# EAGLE design 4-saw-oscillators_rev_1.1 (EAGLE 6.4)
Parts Silver mica 220pF: CD15FD221JO3F, mouser @Kr 4,64 pr stk SSM2212: SSM2212RZ, digi-key @$6.055 pr stk for 10 Tempco: LT300014T261K0J, mouser, @Kr 2.72 pr stk 220k pot: 858-67WR250KLF (250k), mouser @Kr. 5,16 pr. stk 25k pot: 67WR25KLF, mouser @Kr. 6,13 pr. stk 10k pot: 67WR10KLF, mouser @Kr. 6,13 pr. stk
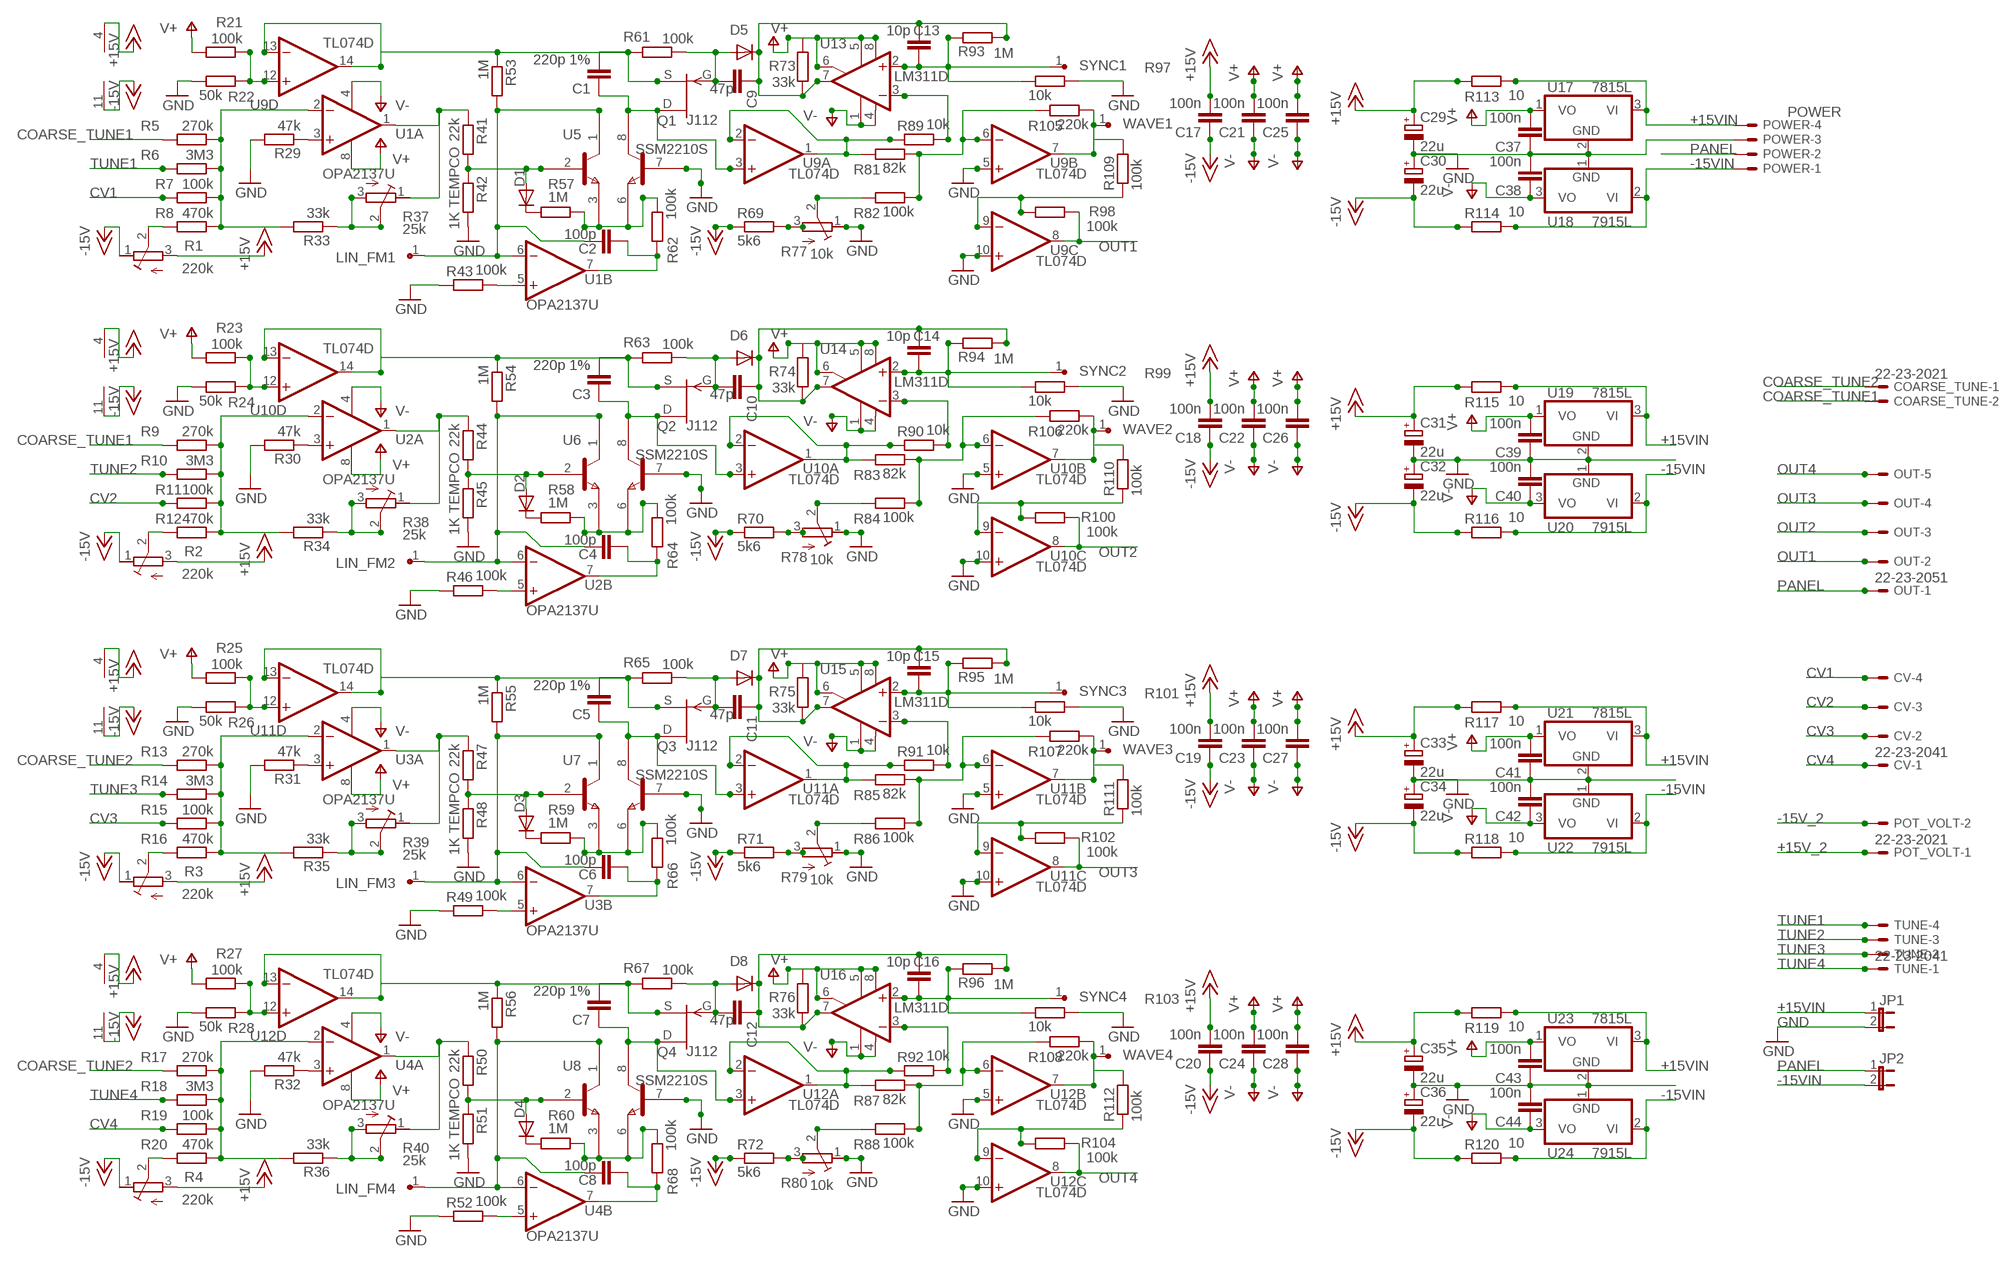
[diagram p0: schematic, sheet 1]

## Parts
C1  220p 1%  C-EU059-025X117  [C059-025X117]
C2  100p  C-EU025-025X050  [C025-025X050]
C3  220p 1%  C-EU059-025X117  [C059-025X117]
C4  100p  C-EU025-025X050  [C025-025X050]
C5  220p 1%  C-EU059-025X117  [C059-025X117]
C6  100p  C-EU025-025X050  [C025-025X050]
C7  220p 1%  C-EU059-025X117  [C059-025X117]
C8  100p  C-EU025-025X050  [C025-025X050]
C9  47p  C-EU025-025X050  [C025-025X050]
C10  47p  C-EU025-025X050  [C025-025X050]
C11  47p  C-EU025-025X050  [C025-025X050]
C12  47p  C-EU025-025X050  [C025-025X050]
C13  10p  C-EU050-025X075  [C050-025X075]
C14  10p  C-EU050-025X075  [C050-025X075]
C15  10p  C-EU050-025X075  [C050-025X075]
C16  10p  C-EU050-025X075  [C050-025X075]
C17  100n  C-EU025-024X044  [C025-024X044]
C18  100n  C-EU025-024X044  [C025-024X044]
C19  100n  C-EU025-024X044  [C025-024X044]
C20  100n  C-EU025-024X044  [C025-024X044]
C21  100n  C-EU025-024X044  [C025-024X044]
C22  100n  C-EU025-024X044  [C025-024X044]
C23  100n  C-EU025-024X044  [C025-024X044]
C24  100n  C-EU025-024X044  [C025-024X044]
C25  100n  C-EU025-024X044  [C025-024X044]
C26  100n  C-EU025-024X044  [C025-024X044]
C27  100n  C-EU025-024X044  [C025-024X044]
C28  100n  C-EU025-024X044  [C025-024X044]
C29  22u  CPOL-EUE2-5  [E2-5]
C30  22u  CPOL-EUE2-5  [E2-5]
C31  22u  CPOL-EUE2-5  [E2-5]
C32  22u  CPOL-EUE2-5  [E2-5]
C33  22u  CPOL-EUE2-5  [E2-5]
C34  22u  CPOL-EUE2-5  [E2-5]
C35  22u  CPOL-EUE2-5  [E2-5]
C36  22u  CPOL-EUE2-5  [E2-5]
C37  100n  C-EU025-024X044  [C025-024X044]
C38  100n  C-EU025-024X044  [C025-024X044]
C39  100n  C-EU025-024X044  [C025-024X044]
C40  100n  C-EU025-024X044  [C025-024X044]
C41  100n  C-EU025-024X044  [C025-024X044]
C42  100n  C-EU025-024X044  [C025-024X044]
C43  100n  C-EU025-024X044  [C025-024X044]
C44  100n  C-EU025-024X044  [C025-024X044]
COARSE_TUNE  22-23-2021  [22-23-2021]
CV  22-23-2041  [22-23-2041]
D1  1N4148  DIODE-D-5  [D-5]
D2  1N4148  DIODE-D-5  [D-5]
D3  1N4148  DIODE-D-5  [D-5]
D4  1N4148  DIODE-D-5  [D-5]
D5  1N4148  DIODE-D-5  [D-5]
D6  1N4148  DIODE-D-5  [D-5]
D7  1N4148  DIODE-D-5  [D-5]
D8  1N4148  DIODE-D-5  [D-5]
JP1  JP1E  [JP1]
JP2  JP1E  [JP1]
LIN_FM1  SINGLE_PAD  [SINGLE_PAD]
LIN_FM2  SINGLE_PAD  [SINGLE_PAD]
LIN_FM3  SINGLE_PAD  [SINGLE_PAD]
LIN_FM4  SINGLE_PAD  [SINGLE_PAD]
OUT  22-23-2051  [22-23-2051]
POT_VOLT  22-23-2021  [22-23-2021]
POWER  POWER  KK-156-4  [KK-156-4]
Q1  J112  [TO92]
Q2  J112  [TO92]
Q3  J112  [TO92]
Q4  J112  [TO92]
R1  220k  R-TRIMMT93YA  [RTRIMT93YA]
R2  220k  R-TRIMMT93YA  [RTRIMT93YA]
R3  220k  R-TRIMMT93YA  [RTRIMT93YA]
R4  220k  R-TRIMMT93YA  [RTRIMT93YA]
R5  270k  R-EU_0204/5  [0204/5]
R6  3M3  R-EU_0204/5  [0204/5]
R7  100k  R-EU_0204/5  [0204/5]
R8  470k  R-EU_0204/5  [0204/5]
R9  270k  R-EU_0204/5  [0204/5]
R10  3M3  R-EU_0204/5  [0204/5]
R11  100k  R-EU_0204/5  [0204/5]
R12  470k  R-EU_0204/5  [0204/5]
R13  270k  R-EU_0204/5  [0204/5]
R14  3M3  R-EU_0204/5  [0204/5]
R15  100k  R-EU_0204/5  [0204/5]
R16  470k  R-EU_0204/5  [0204/5]
R17  270k  R-EU_0204/5  [0204/5]
R18  3M3  R-EU_0204/5  [0204/5]
R19  100k  R-EU_0204/5  [0204/5]
R20  470k  R-EU_0204/5  [0204/5]
R21  100k  R-EU_0204/5  [0204/5]
R22  50k  R-EU_0204/5  [0204/5]
R23  100k  R-EU_0204/5  [0204/5]
R24  50k  R-EU_0204/5  [0204/5]
R25  100k  R-EU_0204/5  [0204/5]
R26  50k  R-EU_0204/5  [0204/5]
R27  100k  R-EU_0204/5  [0204/5]
R28  50k  R-EU_0204/5  [0204/5]
R29  47k  R-EU_0204/5  [0204/5]
R30  47k  R-EU_0204/5  [0204/5]
R31  47k  R-EU_0204/5  [0204/5]
R32  47k  R-EU_0204/5  [0204/5]
R33  33k  R-EU_0204/5  [0204/5]
R34  33k  R-EU_0204/5  [0204/5]
R35  33k  R-EU_0204/5  [0204/5]
R36  33k  R-EU_0204/5  [0204/5]
R37  25k  R-TRIMMT93YA  [RTRIMT93YA]
R38  25k  R-TRIMMT93YA  [RTRIMT93YA]
R39  25k  R-TRIMMT93YA  [RTRIMT93YA]
R40  25k  R-TRIMMT93YA  [RTRIMT93YA]
R41  22k  R-EU_0204/5  [0204/5]
R42  1K TEMPCO  R-EU_0204/7  [0204/7]
R43  100k  R-EU_0204/5  [0204/5]
R44  22k  R-EU_0204/5  [0204/5]
R45  1K TEMPCO  R-EU_0204/7  [0204/7]
R46  100k  R-EU_0204/5  [0204/5]
R47  22k  R-EU_0204/5  [0204/5]
R48  1K TEMPCO  R-EU_0204/7  [0204/7]
R49  100k  R-EU_0204/5  [0204/5]
R50  22k  R-EU_0204/5  [0204/5]
R51  1K TEMPCO  R-EU_0204/7  [0204/7]
R52  100k  R-EU_0204/5  [0204/5]
R53  1M  R-EU_0204/5  [0204/5]
R54  1M  R-EU_0204/5  [0204/5]
R55  1M  R-EU_0204/5  [0204/5]
R56  1M  R-EU_0204/5  [0204/5]
R57  1M  R-EU_0204/5  [0204/5]
R58  1M  R-EU_0204/5  [0204/5]
R59  1M  R-EU_0204/5  [0204/5]
R60  1M  R-EU_0204/5  [0204/5]
R61  100k  R-EU_0204/5  [0204/5]
R62  100k  R-EU_0204/5  [0204/5]
R63  100k  R-EU_0204/5  [0204/5]
R64  100k  R-EU_0204/5  [0204/5]
R65  100k  R-EU_0204/5  [0204/5]
R66  100k  R-EU_0204/5  [0204/5]
R67  100k  R-EU_0204/5  [0204/5]
R68  100k  R-EU_0204/5  [0204/5]
R69  5k6  R-EU_0204/5  [0204/5]
R70  5k6  R-EU_0204/5  [0204/5]
R71  5k6  R-EU_0204/5  [0204/5]
R72  5k6  R-EU_0204/5  [0204/5]
R73  33k  R-EU_0204/5  [0204/5]
R74  33k  R-EU_0204/5  [0204/5]
R75  33k  R-EU_0204/5  [0204/5]
R76  33k  R-EU_0204/5  [0204/5]
R77  10k  R-TRIMMT93YA  [RTRIMT93YA]
R78  10k  R-TRIMMT93YA  [RTRIMT93YA]
R79  10k  R-TRIMMT93YA  [RTRIMT93YA]
R80  10k  R-TRIMMT93YA  [RTRIMT93YA]
R81  82k  R-EU_0204/5  [0204/5]
R82  100k  R-EU_0204/5  [0204/5]
R83  82k  R-EU_0204/5  [0204/5]
R84  100k  R-EU_0204/5  [0204/5]
R85  82k  R-EU_0204/5  [0204/5]
R86  100k  R-EU_0204/5  [0204/5]
R87  82k  R-EU_0204/5  [0204/5]
R88  100k  R-EU_0204/5  [0204/5]
R89  10k  R-EU_0204/5  [0204/5]
R90  10k  R-EU_0204/5  [0204/5]
R91  10k  R-EU_0204/5  [0204/5]
R92  10k  R-EU_0204/5  [0204/5]
R93  1M  R-EU_0204/5  [0204/5]
R94  1M  R-EU_0204/5  [0204/5]
R95  1M  R-EU_0204/5  [0204/5]
R96  1M  R-EU_0204/5  [0204/5]
R97  10k  R-EU_0204/5  [0204/5]
R98  100k  R-EU_0204/5  [0204/5]
R99  10k  R-EU_0204/5  [0204/5]
R100  100k  R-EU_0204/5  [0204/5]
R101  10k  R-EU_0204/5  [0204/5]
R102  100k  R-EU_0204/5  [0204/5]
R103  10k  R-EU_0204/5  [0204/5]
R104  100k  R-EU_0204/5  [0204/5]
R105  220k  R-EU_0204/5  [0204/5]
R106  220k  R-EU_0204/5  [0204/5]
R107  220k  R-EU_0204/5  [0204/5]
R108  220k  R-EU_0204/5  [0204/5]
R109  100k  R-EU_0204/5  [0204/5]
R110  100k  R-EU_0204/5  [0204/5]
R111  100k  R-EU_0204/5  [0204/5]
R112  100k  R-EU_0204/5  [0204/5]
R113  10  R-EU_0204/2V  [0204V]
R114  10  R-EU_0204/2V  [0204V]
R115  10  R-EU_0204/2V  [0204V]
R116  10  R-EU_0204/2V  [0204V]
R117  10  R-EU_0204/2V  [0204V]
R118  10  R-EU_0204/2V  [0204V]
R119  10  R-EU_0204/2V  [0204V]
R120  10  R-EU_0204/2V  [0204V]
SYNC1  SINGLE_PAD  [SINGLE_PAD]
SYNC2  SINGLE_PAD  [SINGLE_PAD]
SYNC3  SINGLE_PAD  [SINGLE_PAD]
SYNC4  SINGLE_PAD  [SINGLE_PAD]
TUNE  22-23-2041  [22-23-2041]
U1  OPA2137U  [SO08]
U2  OPA2137U  [SO08]
U3  OPA2137U  [SO08]
U4  OPA2137U  [SO08]
U5  SSM2210S  [SO08@1]
U6  SSM2210S  [SO08@1]
U7  SSM2210S  [SO08@1]
U8  SSM2210S  [SO08@1]
U9  TL074D  [SO14]
U10  TL074D  [SO14]
U11  TL074D  [SO14]
U12  TL074D  [SO14]
U13  LM311D  [SO08]
U14  LM311D  [SO08]
U15  LM311D  [SO08]
U16  LM311D  [SO08]
U17  7815L  [TO92]
U18  7915L  [TO92]
U19  7815L  [TO92]
U20  7915L  [TO92]
U21  7815L  [TO92]
U22  7915L  [TO92]
U23  7815L  [TO92]
U24  7915L  [TO92]
WAVE1  SINGLE_PAD  [SINGLE_PAD]
WAVE2  SINGLE_PAD  [SINGLE_PAD]
WAVE3  SINGLE_PAD  [SINGLE_PAD]
WAVE4  SINGLE_PAD  [SINGLE_PAD]

## Nets
+15V_1: C17.2 C29.+ R113.1 U9.4(P:V+) ; supply symbol labelled +15V
+15V_2: C18.2 C31.+ POT_VOLT.1 R1.3(E) R2.3(E) R115.1 U10.4(P:V+) ; supply symbol labelled +15V
+15V_3: C19.2 C33.+ R117.1 U11.4(P:V+) ; supply symbol labelled +15V
+15V_4: C20.2 C35.+ R3.3(E) R4.3(E) R119.1 U12.4(P:V+) ; supply symbol labelled +15V
+15VIN: JP1.1 POWER.4 R113.2 R115.2 R117.2 R119.2 U17.3(VI) U19.3(VI) U21.3(VI) U23.3(VI)
-15V_1: C17.1 C30.- R69.1 R114.1 U9.11(P:V-) ; supply symbol labelled -15V
-15V_2: C18.1 C32.- POT_VOLT.2 R1.1(A) R2.1(A) R70.1 R116.1 U10.11(P:V-) ; supply symbol labelled -15V
-15V_3: C19.1 C34.- R71.1 R118.1 U11.11(P:V-) ; supply symbol labelled -15V
-15V_4: C20.1 C36.- R3.1(A) R4.1(A) R72.1 R120.1 U12.11(P:V-) ; supply symbol labelled -15V
-15VIN: JP2.2 POWER.1 R114.2 R116.2 R118.2 R120.2 U18.2(VI) U20.2(VI) U22.2(VI) U24.2(VI)
COARSE_TUNE1: COARSE_TUNE.2 R5.2 R9.2
COARSE_TUNE2: COARSE_TUNE.1 R13.2 R17.2
CV1: CV.4 R7.2
CV2: CV.3 R11.2
CV3: CV.2 R15.2
CV4: CV.1 R19.2
GND: C29.- C30.+ C31.- C32.+ C33.- C34.+ C35.- C36.+ C37.1 C38.2 C39.1 C40.2 C41.1 C42.2 C43.1 C44.2 JP1.2 POWER.3 R22.1 R24.1 R26.1 R28.1 R29.2 R30.2 R31.2 R32.2 R42.2 R43.1 R45.2 R46.1 R48.2 R49.1 R51.2 R52.1 R77.1(A) R78.1(A) R79.1(A) R80.1(A) R97.2 R99.2 R101.2 R103.2 U5.7(B2) U6.7(B2) U7.7(B2) U8.7(B2) U9.5(B:+IN) U9.10(C:+IN) U10.5(B:+IN) U10.10(C:+IN) U11.5(B:+IN) U11.10(C:+IN) U12.5(B:+IN) U12.10(C:+IN) U17.2(GND) U18.1(GND) U19.2(GND) U20.1(GND) U21.2(GND) U22.1(GND) U23.2(GND) U24.1(GND)
N$1: D1.A R41.2 R42.1 U5.2(B1)
N$2: R21.1 R22.2 U9.12(D:+IN)
N$3: C1.2 Q1.2(S) R53.1 R61.2 U9.13(D:-IN) U9.14(D:OUT)
N$4: R23.1 R24.2 U10.12(D:+IN)
N$5: R57.2 R62.2 U5.3(E1) U5.6(E2)
N$6: R29.1 U1.3(A:+IN)
N$7: C2.2 R62.1 U1.7(B:OUT)
N$8: R37.1(A) R41.1 U1.1(A:OUT)
N$9: R43.2 U1.5(B:+IN)
N$10: C2.1 LIN_FM1.1 R53.2 U1.6(B:-IN) U5.1(C1)
N$11: C1.1 Q1.1(D) U5.8(C2) U9.3(A:+IN)
N$12: R81.1 R89.1 U9.1(A:OUT) U9.2(A:-IN)
N$13: D1.C R57.1
N$14: C9.2 D5.A Q1.3(G) R61.1
N$15: C9.1 C13.2 D5.C R73.1 R93.1 U13.7(OUT)
N$16: R69.2 R77.3(E)
N$17: R89.2 U13.3(-IN)
N$18: C13.1 R93.2 R97.1 SYNC1.1 U13.2(+IN)
N$19: R81.2 R82.1 R105.1 U9.6(B:-IN)
N$20: R33.1 R37.2(S) R37.3(E)
N$21: C3.2 Q2.2(S) R54.1 R63.2 U10.13(D:-IN) U10.14(D:OUT)
N$22: R1.2(S) R8.2
N$23: R77.2(S) R82.2
N$24: R98.1 R109.1 U9.9(C:-IN)
N$25: R38.1(A) R44.1 U2.1(A:OUT)
N$26: D2.A R44.2 R45.1 U6.2(B1)
N$27: R58.2 R64.2 U6.3(E1) U6.6(E2)
N$28: C4.2 R64.1 U2.7(B:OUT)
N$29: C4.1 LIN_FM2.1 R54.2 U2.6(B:-IN) U6.1(C1)
N$30: C3.1 Q2.1(D) U6.8(C2) U10.3(A:+IN)
N$31: R83.1 R90.1 U10.1(A:OUT) U10.2(A:-IN)
N$32: D2.C R58.1
N$33: C10.2 D6.A Q2.3(G) R63.1
N$34: C10.1 C14.2 D6.C R74.1 R94.1 U14.7(OUT)
N$35: R90.2 U14.3(-IN)
N$36: C14.1 R94.2 R99.1 SYNC2.1 U14.2(+IN)
N$37: R83.2 R84.1 R106.1 U10.6(B:-IN)
N$38: R2.2(S) R12.2
N$39: R78.2(S) R84.2
N$40: R70.2 R78.3(E)
N$41: R34.1 R38.2(S) R38.3(E)
N$42: R100.1 R110.1 U10.9(C:-IN)
N$43: R46.2 U2.5(B:+IN)
N$44: R30.1 U2.3(A:+IN)
N$45: R9.1 R10.1 R11.1 R12.1 R34.2 U2.2(A:-IN)
N$46: R25.1 R26.2 U11.12(D:+IN)
N$47: C5.2 Q3.2(S) R55.1 R65.2 U11.13(D:-IN) U11.14(D:OUT)
N$48: R39.1(A) R47.1 U3.1(A:OUT)
N$49: D3.A R47.2 R48.1 U7.2(B1)
N$50: R59.2 R66.2 U7.3(E1) U7.6(E2)
N$51: C6.2 R66.1 U3.7(B:OUT)
N$52: C6.1 LIN_FM3.1 R55.2 U3.6(B:-IN) U7.1(C1)
N$53: C5.1 Q3.1(D) U7.8(C2) U11.3(A:+IN)
N$54: R85.1 R91.1 U11.1(A:OUT) U11.2(A:-IN)
N$55: D3.C R59.1
N$56: C11.2 D7.A Q3.3(G) R65.1
N$57: C11.1 C15.2 D7.C R75.1 R95.1 U15.7(OUT)
N$58: R91.2 U15.3(-IN)
N$59: C15.1 R95.2 R101.1 SYNC3.1 U15.2(+IN)
N$60: R85.2 R86.1 R107.1 U11.6(B:-IN)
N$61: R3.2(S) R16.2
N$62: R79.2(S) R86.2
N$63: R71.2 R79.3(E)
N$64: R35.1 R39.2(S) R39.3(E)
N$65: R102.1 R111.1 U11.9(C:-IN)
N$66: R49.2 U3.5(B:+IN)
N$67: R31.1 U3.3(A:+IN)
N$68: R13.1 R14.1 R15.1 R16.1 R35.2 U3.2(A:-IN)
N$69: R27.1 R28.2 U12.12(D:+IN)
N$70: C7.2 Q4.2(S) R56.1 R67.2 U12.13(D:-IN) U12.14(D:OUT)
N$71: R40.1(A) R50.1 U4.1(A:OUT)
N$72: D4.A R50.2 R51.1 U8.2(B1)
N$73: R60.2 R68.2 U8.3(E1) U8.6(E2)
N$74: C8.2 R68.1 U4.7(B:OUT)
N$75: C8.1 LIN_FM4.1 R56.2 U4.6(B:-IN) U8.1(C1)
N$76: C7.1 Q4.1(D) U8.8(C2) U12.3(A:+IN)
N$77: R87.1 R92.1 U12.1(A:OUT) U12.2(A:-IN)
N$78: D4.C R60.1
N$79: C12.2 D8.A Q4.3(G) R67.1
N$80: C12.1 C16.2 D8.C R76.1 R96.1 U16.7(OUT)
N$81: R92.2 U16.3(-IN)
N$82: C16.1 R96.2 R103.1 SYNC4.1 U16.2(+IN)
N$83: R87.2 R88.1 R108.1 U12.6(B:-IN)
N$84: R4.2(S) R20.2
N$85: R80.2(S) R88.2
N$86: R72.2 R80.3(E)
N$87: R36.1 R40.2(S) R40.3(E)
N$88: R104.1 R112.1 U12.9(C:-IN)
N$89: R52.2 U4.5(B:+IN)
N$90: R32.1 U4.3(A:+IN)
N$91: R17.1 R18.1 R19.1 R20.1 R36.2 U4.2(A:-IN)
N$93: R5.1 R6.1 R7.1 R8.1 R33.2 U1.2(A:-IN)
NOTHING: R105.2 R109.2 U9.7(B:OUT) WAVE1.1
NOTHING1: R106.2 R110.2 U10.7(B:OUT) WAVE2.1
NOTHING2: R107.2 R111.2 U11.7(B:OUT) WAVE3.1
NOTHING3: R108.2 R112.2 U12.7(B:OUT) WAVE4.1
OUT1: OUT.2 R98.2 U9.8(C:OUT)
OUT2: OUT.3 R100.2 U10.8(C:OUT)
OUT3: OUT.4 R102.2 U11.8(C:OUT)
OUT4: OUT.5 R104.2 U12.8(C:OUT)
PANEL: JP2.1 OUT.1 POWER.2
TUNE1: R6.2 TUNE.4
TUNE2: R10.2 TUNE.3
TUNE3: R14.2 TUNE.2
TUNE4: R18.2 TUNE.1
V+_1: C21.2 C25.2 C37.2 R21.2 R73.2 U1.8(A:V+) U13.5(ON) U13.6(ON/STR) U13.8(V+) U17.1(VO) ; supply symbol labelled V+
V+_2: C22.2 C26.2 C39.2 R23.2 R74.2 U2.8(A:V+) U14.5(ON) U14.6(ON/STR) U14.8(V+) U19.1(VO) ; supply symbol labelled V+
V+_3: C23.2 C27.2 C41.2 R25.2 R75.2 U3.8(A:V+) U15.5(ON) U15.6(ON/STR) U15.8(V+) U21.1(VO) ; supply symbol labelled V+
V+_4: C24.2 C28.2 C43.2 R27.2 R76.2 U4.8(A:V+) U16.5(ON) U16.6(ON/STR) U16.8(V+) U23.1(VO) ; supply symbol labelled V+
V-_1: C21.1 C25.1 C38.1 U1.4(A:V-) U13.1(GND) U13.4(V-) U18.3(VO) ; supply symbol labelled V-
V-_2: C22.1 C26.1 C40.1 U2.4(A:V-) U14.1(GND) U14.4(V-) U20.3(VO) ; supply symbol labelled V-
V-_3: C23.1 C27.1 C42.1 U3.4(A:V-) U15.1(GND) U15.4(V-) U22.3(VO) ; supply symbol labelled V-
V-_4: C24.1 C28.1 C44.1 U4.4(A:V-) U16.1(GND) U16.4(V-) U24.3(VO) ; supply symbol labelled V-

## Library data of the parts
C1-C28 C37-C44 = resistor:C-EU: CAPACITOR, European symbol
C29-C36 = resistor:CPOL-EU: POLARIZED CAPACITOR, European symbol
COARSE_TUNE POT_VOLT = con-molex:22-23-2021: .100" (2.54mm) Center Header - 2 Pin
CV TUNE = con-molex:22-23-2041: .100" (2.54mm) Center Header - 4 Pin
D1-D8 = diode:DIODE-: DIODE
JP1 JP2 = jumper:JP1E: JUMPER
LIN_FM1-LIN_FM4 SYNC1-SYNC4 WAVE1-WAVE4 = joakim:SINGLE_PAD: Single pad/connector
OUT = con-molex:22-23-2051: .100" (2.54mm) Center Header - 5 Pin
POWER = con-molex:KK-156-4: KK 156 HEADER Source: http://www.molex.com/pdm_docs/sd/026604100_sd.pdf
Q1-Q4 = synthdiy:J112: N-channel Field Effect-TRANSISTOR
R1-R4 R37-R40 R77-R80 = resistor:R-TRIMM: Trimm resistor
R5-R36 R41-R76 R81-R120 = resistor:R-EU_: RESISTOR, European symbol
U1-U4 = synthdiy:OPA2137: Dual FET-Input OPA
U5-U8 = synthdiy:SSM2210: Audio Dual Matched NPN TRANSISTOR
U9-U12 = linear:TL074: OP AMP
U13-U16 = synthdiy:LM311: COMPARATOR
U17 U19 U21 U23 = linear:78*: Positive VOLTAGE REGULATOR Source: http://cache.national.com/ds/LM/LM78L05.pdf http://www.fairchildsemi.com/ds/LM/LM7805.pdf
U18 U20 U22 U24 = linear:79*: Negative VOLTAGE REGULATOR

## Board
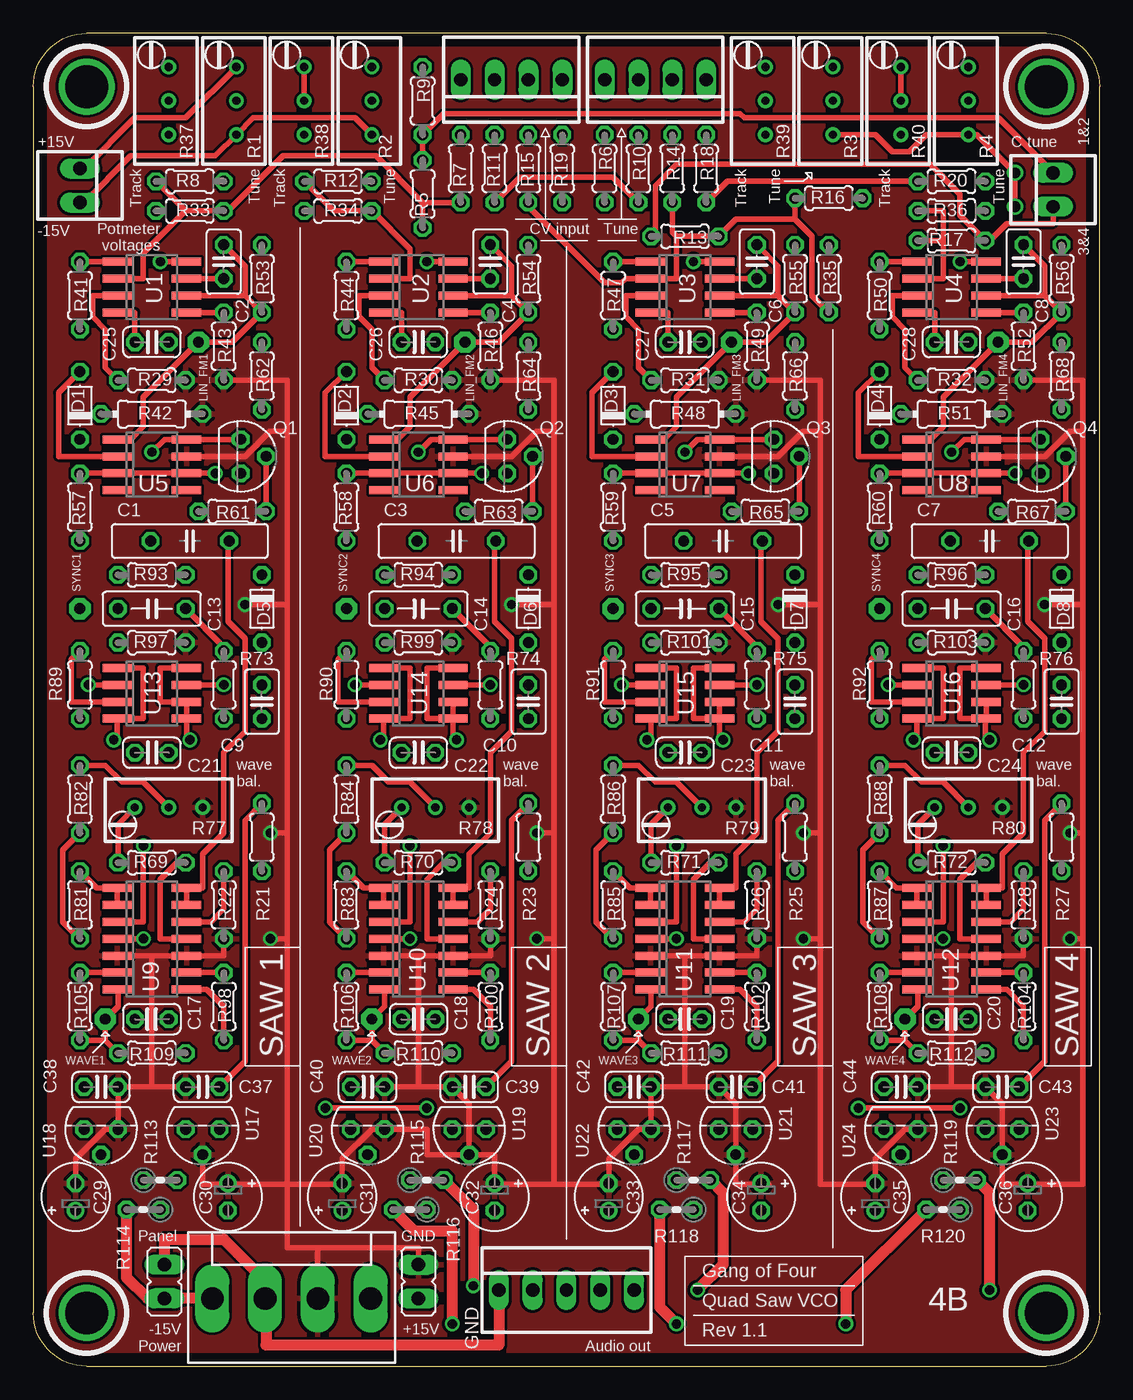
[diagram p1: board, top side]
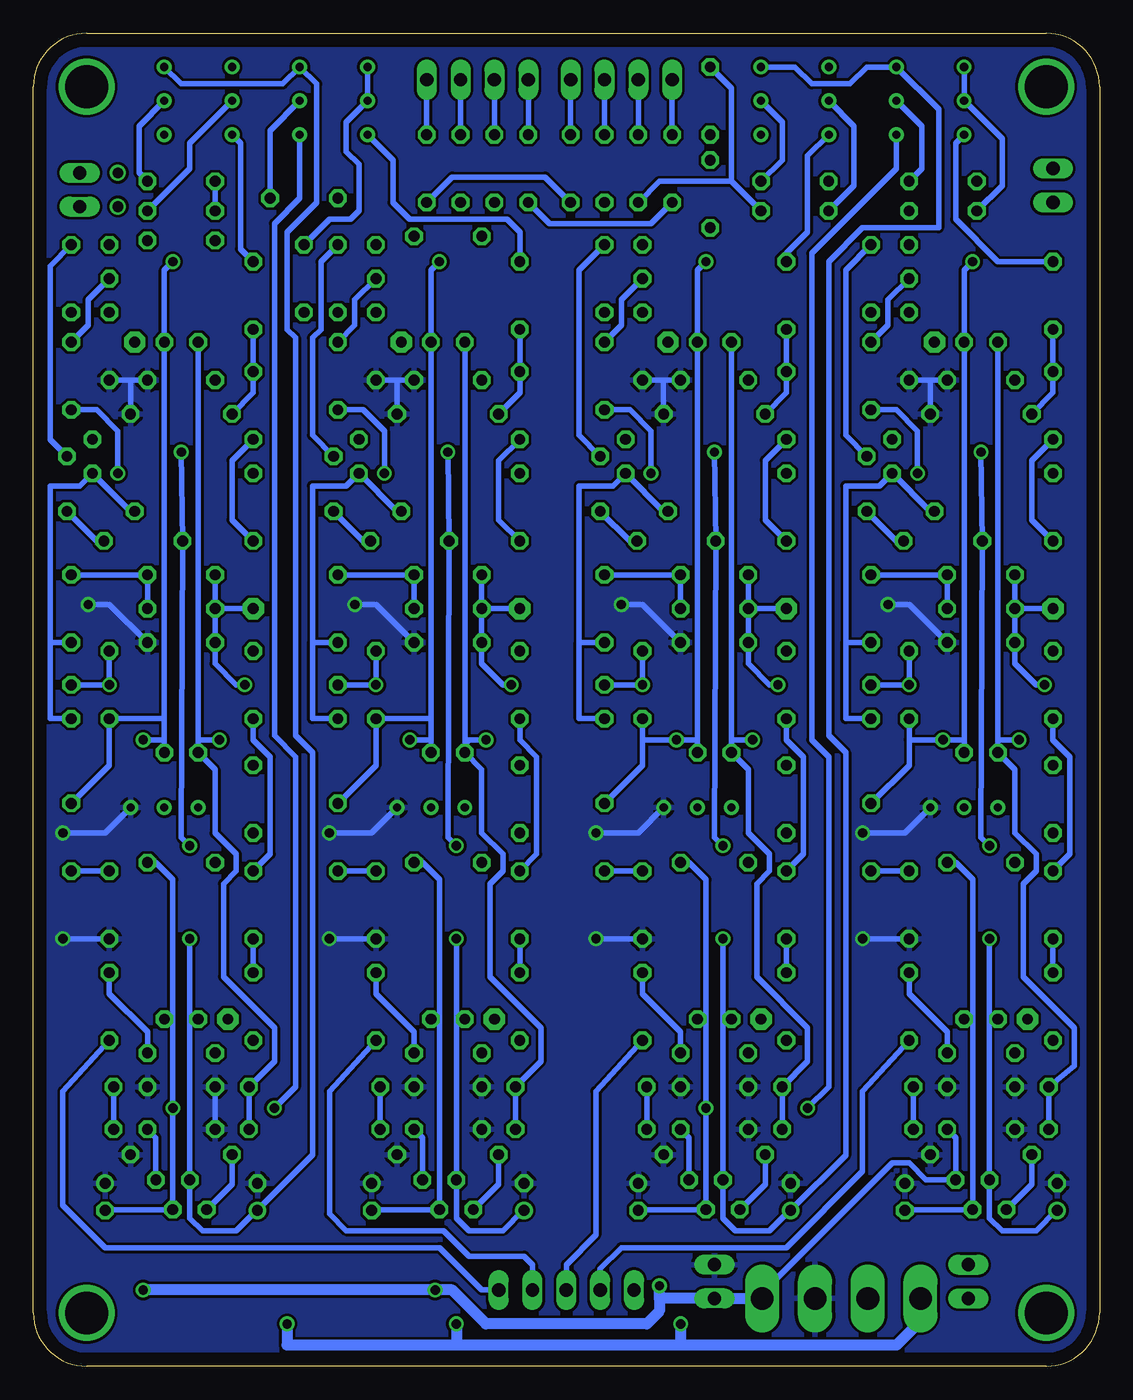
[diagram p2: board, bottom side, seen from below]

Size 80 x 100 mm. Coordinates in mm from the lower left corner, seen from the top.
Outline: 4,0 76,0 arc90 80,4 80,96 arc90 76,100 4,100 arc90 0,96 0,4 arc90 4,0
Copper layers (1*16): Top 0.035mm / dielectric 1.5mm / Bottom 0.035mm
Design rules "default *": minimum track width 10mil, minimum drill 24mil, track to track 8mil, track to pad 8mil, pad to pad 8mil, via to via 8mil, smd to smd 8mil, copper to edge 40mil, drill to drill 8mil, minimum pad ring 10mil, minimum via ring 8mil, stop-mask expansion 8mil, vias tented up to drill 0mil, thermal gap 10mil

### Footprints (pad centres in the part's own frame; a part is rotated, then mirrored left to right if it is on the bottom)
C059-025X117 = drill 0.813 octagon: 1 -2.95,0; 2 2.95,0
C025-025X050 = drill 0.813 octagon: 1 -1.27,0; 2 1.27,0
C050-025X075 = drill 0.813 octagon: 1 -2.54,0; 2 2.54,0
C025-024X044 = drill 0.813 octagon: 1 -1.27,0; 2 1.27,0
E2-5 = drill 0.813 pad 1.27: + -1.016,0 | drill 0.813 pad 1.27 octagon: - 1.016,0
22-23-2021 = drill 1 long: 1 -1.27,0; 2 1.27,0
22-23-2041 = drill 1 long: 1 -3.81,0; 2 -1.27,0; 3 1.27,0; 4 3.81,0
D-5 = drill 0.813 octagon: A 2.54,0; C -2.54,0
JP1 = drill 1 long: 1 0,-1.27; 2 0,1.27
SINGLE_PAD = drill 0.813 pad 1.6 octagon: 1 0,0
22-23-2051 = drill 1 long: 1 -5.08,0; 2 -2.54,0; 3 0,0; 4 2.54,0; 5 5.08,0
KK-156-4 = drill 1.7 pad 2.184 long: 1 -5.94,0; 2 -1.98,0; 3 1.98,0; 4 5.94,0
TO92 = drill 0.813 octagon: 1 -1.27,0; 2 0,1.905; 3 1.27,0
RTRIMT93YA = drill 0.61: 1 0,-2.54; 2 0,0; 3 0,2.54
0204/5 = drill 0.813 octagon: 1 -2.54,0; 2 2.54,0
0204/7 = drill 0.813 octagon: 1 -3.81,0; 2 3.81,0
0204V = drill 0.813 octagon: 1 -1.27,0; 2 1.27,0
SO08 = smd 0.6 x 2.2: 1 -1.905,-2.6; 2 -0.635,-2.6; 3 0.635,-2.6; 4 1.905,-2.6; 5 1.905,2.6; 6 0.635,2.6; 7 -0.635,2.6; 8 -1.905,2.6
SO08@1 = smd 0.6 x 2.2: 1 -1.905,-2.6; 2 -0.635,-2.6; 3 0.635,-2.6; 4 1.905,-2.6; 5 1.905,2.6; 6 0.635,2.6; 7 -0.635,2.6; 8 -1.905,2.6
SO14 = smd 0.6 x 2.2: 1 -3.81,-2.6; 2 -2.54,-2.6; 3 -1.27,-2.6; 4 0,-2.6; 5 1.27,-2.6; 6 2.54,-2.6; 7 3.81,-2.6; 8 3.81,2.6; 9 2.54,2.6; 10 1.27,2.6; 11 0,2.6; 12 -1.27,2.6; 13 -2.54,2.6; 14 -3.81,2.6

### Placement (x,y rotation side)
C1  11.75,61.91 0 top
C2  14.29,82.87 270 top
C3  31.75,61.91 0 top
C4  34.29,82.87 270 top
C5  51.75,61.91 0 top
C6  54.29,82.87 270 top
C7  71.75,61.91 0 top
C8  74.3,82.87 270 top
C9  17.14,49.85 270 top
C10  37.15,49.85 270 top
C11  57.15,49.85 270 top
C12  77.15,49.85 270 top
C13  8.89,56.83 0 top
C14  28.89,56.83 0 top
C15  48.9,56.83 0 top
C16  68.9,56.83 0 top
C17  8.89,26.04 180 top
C18  28.89,26.04 180 top
C19  48.9,26.04 180 top
C20  68.9,26.04 180 top
C21  8.89,46.04 0 top
C22  28.89,46.04 0 top
C23  48.9,46.04 0 top
C24  68.9,46.04 0 top
C25  8.89,76.83 0 top
C26  28.89,76.83 0 top
C27  48.9,76.83 0 top
C28  68.9,76.83 0 top
C29  3.17,12.7 90 top
C30  14.61,12.7 270 top
C31  23.18,12.7 90 top
C32  34.61,12.7 270 top
C33  43.18,12.7 90 top
C34  54.61,12.7 270 top
C35  63.18,12.7 90 top
C36  74.61,12.7 270 top
C37  12.7,20.95 0 top
C38  5.08,20.95 0 top
C39  32.7,20.95 0 top
C40  25.08,20.95 0 top
C41  52.7,20.95 0 top
C42  45.09,20.95 0 top
C43  72.71,20.95 0 top
C44  65.09,20.95 0 top
COARSE_TUNE  76.52,88.27 90 top
CV  35.88,96.52 180 top
D1  3.49,72.07 90 top
D2  23.5,72.07 90 top
D3  43.5,72.07 90 top
D4  63.5,72.07 90 top
D5  17.14,56.83 270 top
D6  37.15,56.83 270 top
D7  57.15,56.83 270 top
D8  77.15,56.83 270 top
JP1  28.89,6.35 0 top
JP2  9.84,6.35 180 top
LIN_FM1  12.38,76.83 0 top
LIN_FM2  32.38,76.83 0 top
LIN_FM3  52.39,76.83 0 top
LIN_FM4  72.39,76.83 0 top
OUT  40.01,5.71 0 top
POT_VOLT  3.49,88.58 270 top
POWER  19.37,5.08 0 top
Q1  15.56,68.26 270 top
Q2  35.56,68.26 270 top
Q3  55.56,68.26 270 top
Q4  75.56,68.26 270 top
R1  15.24,94.93 0 top
R2  25.4,94.93 0 top
R3  60.01,94.93 0 top
R4  70.17,94.93 0 top
R5  29.21,87.95 90 top
R6  42.86,89.85 90 top
R7  32.07,89.85 90 top
R8  11.75,88.9 0 top
R9  29.21,94.93 270 top
R10  45.4,89.85 90 top
R11  34.61,89.85 90 top
R12  22.86,88.9 0 top
R13  48.9,84.77 180 top
R14  47.94,89.85 90 top
R15  37.15,89.85 90 top
R16  59.69,87.63 0 top
R17  68.9,84.45 0 top
R18  50.48,89.85 90 top
R19  39.69,89.85 90 top
R20  68.9,88.9 0 top
R21  17.14,39.69 90 top
R22  14.29,34.61 90 top
R23  37.15,39.69 90 top
R24  34.29,34.61 90 top
R25  57.15,39.69 90 top
R26  54.29,34.61 90 top
R27  77.15,39.69 90 top
R28  74.3,34.61 90 top
R29  8.89,73.98 0 top
R30  28.89,73.98 0 top
R31  48.9,73.98 0 top
R32  68.9,73.98 0 top
R33  11.75,86.68 0 top
R34  22.86,86.68 0 top
R35  59.69,81.6 270 top
R36  68.9,86.68 180 top
R37  10.16,94.93 0 top
R38  20.32,94.93 0 top
R39  54.93,94.93 0 top
R40  65.09,94.93 0 top
R41  3.49,80.33 270 top
R42  8.89,71.44 0 top
R43  14.29,76.52 90 top
R44  23.5,80.33 270 top
R45  28.89,71.44 0 top
R46  34.29,76.52 90 top
R47  43.5,80.33 270 top
R48  48.9,71.44 0 top
R49  54.29,76.52 90 top
R50  63.5,80.33 270 top
R51  68.9,71.44 0 top
R52  74.3,76.52 90 top
R53  17.14,81.6 270 top
R54  37.15,81.6 270 top
R55  57.15,81.6 270 top
R56  77.15,81.6 270 top
R57  3.49,64.45 90 top
R58  23.5,64.45 90 top
R59  43.5,64.45 90 top
R60  63.5,64.45 90 top
R61  14.92,64.14 0 top
R62  17.14,74.3 270 top
R63  34.92,64.14 0 top
R64  37.15,74.3 270 top
R65  54.93,64.14 0 top
R66  57.15,74.3 270 top
R67  74.93,64.14 0 top
R68  77.15,74.3 270 top
R69  8.89,37.78 180 top
R70  28.89,37.78 180 top
R71  48.9,37.78 180 top
R72  68.9,37.78 180 top
R73  14.29,51.12 270 top
R74  34.29,51.12 270 top
R75  54.29,51.12 270 top
R76  74.3,51.12 270 top
R77  10.16,41.91 90 top
R78  30.16,41.91 90 top
R79  50.16,41.91 90 top
R80  70.17,41.91 90 top
R81  3.49,34.61 270 top
R82  3.49,42.55 90 top
R83  23.5,34.61 270 top
R84  23.5,42.55 90 top
R85  43.5,34.61 270 top
R86  43.5,42.55 90 top
R87  63.5,34.61 270 top
R88  63.5,42.55 90 top
R89  3.49,51.12 90 top
R90  23.5,51.12 90 top
R91  43.5,51.12 90 top
R92  63.5,51.12 90 top
R93  8.89,59.37 180 top
R94  28.89,59.37 180 top
R95  48.9,59.37 180 top
R96  68.9,59.37 180 top
R97  8.89,54.29 0 top
R98  14.29,26.99 270 top
R99  28.89,54.29 0 top
R100  34.29,26.99 270 top
R101  48.9,54.29 0 top
R102  54.29,26.99 270 top
R103  68.9,54.29 0 top
R104  74.3,26.99 270 top
R105  3.49,26.99 270 top
R106  23.5,26.99 270 top
R107  43.5,26.99 270 top
R108  63.5,26.99 270 top
R109  8.89,23.5 180 top
R110  28.89,23.5 180 top
R111  48.9,23.5 180 top
R112  68.9,23.5 180 top
R113  9.53,13.97 0 top
R114  8.26,11.75 180 top
R115  29.53,13.97 0 top
R116  28.26,11.75 180 top
R117  49.53,13.97 0 top
R118  48.26,11.75 180 top
R119  69.53,13.97 0 top
R120  68.26,11.75 180 top
SYNC1  3.49,56.83 0 top
SYNC2  23.5,56.83 0 top
SYNC3  43.5,56.83 0 top
SYNC4  63.5,56.83 0 top
TUNE  46.67,96.52 180 top
U1  8.89,80.96 270 top
U2  28.89,80.96 270 top
U3  48.9,80.96 270 top
U4  68.9,80.96 270 top
U5  8.89,67.63 270 top
U6  28.89,67.63 270 top
U7  48.9,67.63 270 top
U8  68.9,67.63 270 top
U9  8.89,32.07 270 top
U10  28.89,32.07 270 top
U11  48.9,32.07 270 top
U12  68.9,32.07 270 top
U13  8.89,50.48 270 top
U14  28.89,50.48 270 top
U15  48.9,50.48 270 top
U16  68.9,50.48 270 top
U17  12.7,17.78 180 top
U18  5.08,17.78 180 top
U19  32.7,17.78 180 top
U20  25.08,17.78 180 top
U21  52.7,17.78 180 top
U22  45.09,17.78 180 top
U23  72.71,17.78 180 top
U24  65.09,17.78 180 top
WAVE1  5.4,26.04 0 top
WAVE2  25.4,26.04 0 top
WAVE3  45.4,26.04 0 top
WAVE4  65.41,26.04 0 top

### Tracks (layer width: path | path; a pad name or v marks a point on that pad's centre or on a via)
+15V_1  (via drill 0.7)
  Top 0.406: U9.4 v8.26,32.07
  Bottom 0.406: 8.26,26.04 R113.1 8.26,11.11 7.3,10.16 4.76,10.16 3.24,11.68 C29.+ | C17.2 8.26,26.04 | v8.26,32.07 8.26,26.04
+15V_2  (via drill 0.7)
  Top 0.406: U10.4 v28.26,32.07 | R1.3 11.43,93.66 7.62,93.66 3.81,89.85 POT_VOLT.1
  Bottom 0.406: R2.3 22.86,97.47 21.59,96.2 18.73,96.2 17.46,97.47 R1.3 12.06,94.3 12.06,85.41 17.78,85.41 20.32,82.87 20.32,47.31 19.05,46.04 19.05,15.81 C31.+ 23.24,11.68 24.77,10.16 27.3,10.16 28.26,11.11 R115.1 28.26,25.72 | v28.26,32.07 28.26,25.72 | C18.2 27.94,26.04 28.26,25.72
+15V_3  (via drill 0.7)
  Top 0.406: U11.4 v48.26,32.07
  Bottom 0.406: 48.26,26.04 R117.1 48.26,11.11 47.31,10.16 44.77,10.16 43.24,11.68 C33.+ | C19.2 48.26,26.04 | v48.26,32.07 48.26,26.04
+15V_4  (via drill 0.7)
  Top 0.406: U12.4 v68.26,32.07
  Bottom 0.406: 68.26,26.04 R119.1 68.26,11.11 67.31,10.16 64.77,10.16 63.25,11.68 C35.+ 63.18,11.75 59.05,15.88 59.05,46.04 60.33,47.31 60.33,77.15 60.96,77.79 60.96,85.09 58.74,87.31 58.74,96.2 R3.3 61.28,96.2 68.9,96.2 R4.3 | C20.2 68.26,26.04 | v68.26,32.07 68.26,26.04
+15VIN  (via drill 0.7)
  Top 0.813: R115.2 33.02,11.75 v33.02,6.03 | R117.2 51.75,13.02 51.75,7.62 v49.85,5.71 | v71.75,5.71 71.75,13.02 R119.2
  Bottom 0.406: U17.3 10.79,17.14 R113.2 13.02,13.97 14.29,15.24 15.56,15.24 25.23,5.57 | U19.3 30.8,17.14 R115.2 | U21.3 50.8,17.14 R117.2 | U23.3 70.8,17.14 R119.2
  Bottom 0.813: 33.02,5.08 33.02,4.13 33.97,3.17 46.04,3.17 48.58,5.71 v49.85,5.71 v71.75,5.71 | POWER.4 25.23,5.16 25.23,5.57 25.4,5.73 25.4,5.08 JP1.1 33.02,5.08 | 33.02,5.08 v33.02,6.03
-15V_1
  Top 0.406: U9.11 9.53,32.07 9.53,36.51 10.79,37.78 R69.1
  Bottom 0.406: 9.53,26.04 R114.1 14.54,11.75 C30.- | C17.1 9.53,26.04 | 9.53,26.04 9.53,36.51 10.79,37.78 R69.1
-15V_2  (via drill 0.7)
  Top 0.406: R2.1 24.13,93.66 16.51,93.66 R1.1 13.65,90.81 7.3,90.81 3.81,87.31 POT_VOLT.2 | v21.91,19.37 v29.53,19.37 | U10.11 29.53,32.07 29.53,36.51 30.8,37.78 R70.1
  Bottom 0.406: 29.53,26.04 v29.53,19.37 R116.1 34.35,11.75 C32.- | C18.1 29.53,26.04 | 29.53,26.04 29.53,36.51 30.8,37.78 R70.1 | R1.1 15.24,89.85 21.59,83.5 21.59,46.99 20.32,45.72 20.32,20.95 v21.91,19.37
-15V_3
  Top 0.406: U11.11 49.53,32.07 49.53,36.51 50.8,37.78 R71.1
  Bottom 0.406: 49.53,26.04 R118.1 54.55,11.75 C34.- | C19.1 49.53,26.04 | 49.53,26.04 49.53,36.51 50.8,37.78 R71.1
-15V_4  (via drill 0.7, 0.8)
  Top 0.406: R3.1 63.18,92.39 64.45,91.12 65.72,91.12 66.99,92.39 R4.1 70.8,92.39 v73.66,89.53 v73.66,87 | v61.91,19.37 v69.53,19.37 | U12.11 69.53,32.07 69.53,36.51 70.8,37.78 R72.1
  Bottom 0.406: 69.53,26.04 v69.53,19.37 R120.1 74.55,11.75 C36.- | C20.1 69.53,26.04 | 69.53,26.04 69.53,36.51 70.8,37.78 R72.1 | R3.1 60.01,87.63 61.91,85.72 61.91,47.31 60.33,45.72 60.33,20.95 v61.91,19.37
-15VIN  (via drill 0.7)
  Top 0.813: R114.2 6.99,6.67 8.57,5.08 JP2.2 POWER.1 | R116.2 28.57,10.16 31.43,10.16 v31.43,3.17 | R118.2 46.99,4.45 v48.26,3.17 | R120.2 60.96,5.71 v60.96,3.17
  Bottom 0.406: U18.2 5.08,13.65 R114.2 | U20.2 25.08,13.65 R116.2 | U22.2 45.09,13.65 R118.2 | U24.2 65.09,13.65 R120.2
  Bottom 0.813: 31.43,1.59 15.24,1.59 13.34,3.49 13.34,4.99 POWER.1 | 31.43,1.59 48.26,1.59 | 48.26,1.59 60.96,1.59 v60.96,3.17 | v31.43,3.17 31.43,1.59 | v48.26,3.17 48.26,1.59
COARSE_TUNE1
  Top 0.406: R5.2 R9.2 30.8,93.98 53.02,93.98 53.34,93.66 72.39,93.66 COARSE_TUNE.2
COARSE_TUNE2
  Top 0.406: R13.2 46.67,84.77 46.67,88.58 48.26,90.17 67.31,90.17 69.53,87.95 69.53,86.36 R17.2 71.75,84.45 73.03,85.72 76.52,85.72 COARSE_TUNE.1
CV1
  Bottom 0.406: CV.4 R7.2
CV2
  Bottom 0.406: CV.3 R11.2
CV3
  Bottom 0.406: CV.2 R15.2
CV4
  Bottom 0.406: R19.2 CV.1
GND  (via drill 0.7)
  Top 0.406: U5.7 15.88,68.26 17.78,70.17 19.05,70.17 | U9.5 8.89,30.8 | 8.89,30.8 U9.10 14.29,30.8 R22.1 | v15.88,57.15 19.05,57.15 | 19.05,57.15 19.05,70.17 | 19.05,70.17 19.05,73.98 R43.1 | 19.05,32.07 19.05,40.01 | 19.05,40.01 19.05,57.15 | v17.78,40.01 19.05,40.01 | 19.05,32.07 v17.78,32.07 | 8.89,20.95 C38.2 U18.1 5.4,17.78 3.17,15.56 C29.- | C37.1 8.89,20.95 | 8.89,20.95 8.89,30.8 | U6.7 35.88,68.26 37.78,70.17 39.05,70.17 | U10.5 28.89,30.8 | 28.89,30.8 U10.10 34.29,30.8 R24.1 | v35.88,57.15 39.05,57.15 | 39.05,57.15 39.05,70.17 | 39.05,70.17 39.05,73.98 R46.1 | 39.05,32.07 39.05,40.01 | 39.05,40.01 39.05,57.15 | v37.78,40.01 39.05,40.01 | 39.05,32.07 v37.78,32.07 | 28.89,20.95 C40.2 | 28.89,20.95 C39.1 32.7,19.68 U19.2 | 28.89,20.95 28.89,30.8 | U7.7 55.88,68.26 57.78,70.17 59.05,70.17 | U11.5 48.9,30.8 | 48.9,30.8 U11.10 54.29,30.8 R26.1 | v55.88,57.15 59.05,57.15 | 59.05,57.15 59.05,70.17 | 59.05,70.17 59.05,73.98 R49.1 | 59.05,32.07 59.05,40.01 | 59.05,40.01 59.05,57.15 | v57.78,40.01 59.05,40.01 | 59.05,32.07 v57.78,32.07 | 48.9,20.95 C42.2 U22.1 45.4,17.78 43.18,15.56 C33.- 43.12,13.65 39.05,13.65 | 48.9,20.95 C41.1 52.7,19.68 U21.2 52.7,13.65 55.18,13.65 C34.+ | 48.9,20.95 48.9,30.8 | U8.7 75.88,68.26 77.79,70.17 78.74,70.17 | U12.5 68.9,30.8 | 68.9,30.8 U12.10 74.3,30.8 R28.1 | v75.88,57.15 78.74,57.15 | 78.74,57.15 78.74,70.17 | 78.74,70.17 78.74,73.98 R52.1 | 78.74,40.01 78.74,57.15 | v77.79,40.01 78.74,40.01 | 68.9,20.95 C44.2 | 68.9,20.95 C43.1 72.71,19.68 U23.2 72.71,13.65 74.61,13.65 | 68.9,20.95 68.9,30.8 | 19.05,32.07 19.05,13.65 | 39.05,32.07 39.05,13.65 | 59.05,32.07 59.05,13.65 62.87,13.65 62.93,13.72 C35.- 63.18,15.56 65.41,17.78 U24.1
  Top 0.406: 78.74,40.01 78.74,32.07 | 78.74,32.07 78.74,13.65 74.61,13.65 | 78.74,32.07 v77.79,32.07 | C31.- 23.18,13.65 | 34.54,13.65 C32.+ | C32.+ 34.61,13.65 39.05,13.65 | 19.05,13.65 19.05,8.89 21.35,8.89 | U17.2 12.7,13.65 14.54,13.65 C30.+ 14.61,13.65 19.05,13.65 | 74.55,13.65 C36.+ 74.61,13.65 | U19.2 29.53,15.88 29.53,17.78 U20.1 25.4,17.78 23.18,15.56 C31.- | U19.2 34.61,15.88 C32.+ | 21.35,8.89 POWER.3 21.27,5.08 | 19.05,13.65 23.11,13.65 C31.- | JP1.2 28.89,8.89 21.35,8.89
  Bottom 0.406: R42.2 12.7,73.98 | R43.1 12.7,73.98 | 12.7,73.98 R29.2 | v15.88,57.15 14.29,57.15 R97.2 | R77.1 14.61,40.01 v17.78,40.01 | v17.78,32.07 R22.1 | R45.2 32.7,73.98 | R46.1 32.7,73.98 | 32.7,73.98 R30.2 | v35.88,57.15 34.29,57.15 R99.2 | R78.1 34.61,40.01 v37.78,40.01 | v37.78,32.07 R24.1 | R48.2 52.7,73.98 | R49.1 52.7,73.98 | 52.7,73.98 R31.2 | v55.88,57.15 54.29,57.15 R101.2 | R79.1 54.61,40.01 v57.78,40.01 | v57.78,32.07 R26.1 | R51.2 72.71,73.98 | R52.1 72.71,73.98 | 72.71,73.98 R32.2 | v75.88,57.15 74.3,57.15 R103.2 | R80.1 74.61,40.01 v77.79,40.01 | v77.79,32.07 R28.1 | C44.2 U24.1
  pour Top: 0,100.01 80.01,100.01 80.01,0 0,0
  pour Bottom: 0,100.01 80.01,100.01 80.01,0 0,0
N$1
  Top 0.406: D1.A 1.91,73.03 1.91,68.26 U5.2
  Bottom 0.406: D1.A R41.2 3.49,73.03 R42.1
N$2
  Top 0.406: U9.12 13.34,33.34 14.29,34.29 R22.2
  Bottom 0.406: R21.1 R22.2
N$3
  Top 0.406: U9.13 U9.14 12.7,35.88 12.7,38.42 14.29,40.01 14.29,46.04 15.88,47.62 15.88,54.61 14.61,55.88 14.61,61.91 C1.2 | Q1.2 R61.2
  Bottom 0.406: R53.1 19.05,82.23 19.05,69.85 Q1.2 | C1.2 15.24,61.91 R61.2
N$4
  Top 0.406: U10.12 33.34,33.34 34.29,34.29 R24.2
  Bottom 0.406: R23.1 R24.2
N$5  (via drill 0.7)
  Top 0.406: v13.65,66.99 U5.6 U5.3 R57.2
  Bottom 0.406: v13.65,66.99 13.65,70.17 15.24,71.75 R62.2
N$6
  Top 0.406: U1.3 4.45,80.33 4.45,78.74 5.4,77.79 5.4,74.93 R29.1
N$7
  Top 0.406: U1.7 C2.2
  Bottom 0.406: C2.2 15.88,80.01 15.88,78.11 R62.1
N$8
  Top 0.406: U1.1 R41.1
  Bottom 0.406: R37.1 10.79,91.76 10.79,86.04 7.62,82.87 R41.1
N$9
  Top 0.406: U1.5 R43.2
N$10
  Top 0.406: U5.1 7.3,69.53 8.26,70.48 8.26,72.71 LIN_FM1.1 14.92,76.83 R53.2 15.88,80.33 | C2.1 15.88,82.55 15.88,80.33 | U1.6 15.88,80.33
N$11  (via drill 0.7)
  Top 0.406: Q1.1 U5.8 9.84,69.53 v8.89,68.58 | U9.3 8.26,33.34 v8.26,39.05
  Bottom 0.406: C1.1 8.89,39.69 v8.26,39.05 | v8.89,68.58 C1.1 | 8.89,62.01 C1.1
N$12
  Top 0.406: R81.1 4.76,35.88 U9.1 U9.2
  Bottom 0.406: R81.1 2.22,38.42 2.22,45.72 3.49,46.99 R89.1
N$13
  Bottom 0.406: D1.C 5.08,67.94 5.08,63.5 R57.1
N$14
  Bottom 0.406: 19.05,54.29 19.05,66.04 16.51,66.04 Q1.3 12.7,64.14 R61.1 | 19.05,54.29 D5.A | C9.2 19.05,48.58 19.05,54.29
N$15  (via drill 0.7)
  Top 0.406: U13.7 v14.29,51.12 | R73.1 14.29,53.98 C13.2
  Bottom 0.406: C13.2 R93.1 D5.C | R73.1 v14.29,51.12 C9.1
N$16
  Top 0.406: 6.35,37.47 R69.2 6.35,40.64 R77.3
N$17
  Top 0.406: U13.3 2.86,49.85 2.86,53.02 R89.2
N$18  (via drill 0.7)
  Top 0.406: U13.2 v4.13,51.12
  Bottom 0.406: R93.2 C13.1 | C13.1 R97.1 6.35,52.7 4.76,51.12 v4.13,51.12 | SYNC1.1 C13.1
N$19
  Top 0.406: R105.1 U9.6 | R82.1 2.22,38.73 2.22,33.34 R81.2
  Bottom 0.406: R105.1 R81.2
N$20
  Bottom 0.406: R33.1 7.3,88.58 7.3,92.08 R37.2 R37.3
N$21
  Top 0.406: U10.13 U10.14 32.7,35.88 32.7,38.42 34.29,40.01 34.29,46.04 35.88,47.62 35.88,54.61 34.61,55.88 34.61,61.91 C3.2 | Q2.2 R63.2
  Bottom 0.406: R54.1 39.05,82.23 39.05,69.85 Q2.2 | C3.2 35.24,61.91 R63.2
N$22
  Bottom 0.406: R8.2 13.34,89.85 13.34,93.03 R1.2
N$23
  Top 0.406: R82.2 5.4,45.09 6.67,43.81 8.26,43.81 R77.2
N$24
  Top 0.406: U9.9 R98.1
  Bottom 0.406: R109.1 11.43,25.08 14.29,27.94 R98.1
N$25
  Top 0.406: U2.1 R44.1
  Bottom 0.406: R38.1 21.91,90.81 21.91,85.09 23.5,83.5 R44.1
N$26
  Top 0.406: D2.A 21.91,73.03 21.91,68.26 U6.2
  Bottom 0.406: D2.A R44.2 23.5,73.03 R45.1
N$27  (via drill 0.7)
  Top 0.406: v33.66,66.99 U6.6 U6.3 R58.2
  Bottom 0.406: v33.66,66.99 33.66,70.17 35.24,71.75 R64.2
N$28
  Top 0.406: U2.7 C4.2
  Bottom 0.406: C4.2 35.88,80.01 35.88,78.11 R64.1
N$29
  Top 0.406: U6.1 27.3,69.53 28.26,70.48 28.26,72.71 LIN_FM2.1 34.92,76.83 R54.2 35.88,80.33 | C4.1 35.88,82.55 35.88,80.33 | U2.6 35.88,80.33
N$30  (via drill 0.7)
  Top 0.406: Q2.1 U6.8 29.84,69.53 v28.89,68.58 | U10.3 28.26,33.34 v28.26,39.05
  Bottom 0.406: v28.26,39.05 28.89,39.69 C3.1 v28.89,68.58
N$31
  Top 0.406: R83.1 24.77,35.88 U10.1 U10.2
  Bottom 0.406: R83.1 22.23,38.42 22.23,45.72 23.5,46.99 R90.1
N$32
  Bottom 0.406: D2.C 25.08,67.94 25.08,63.5 R58.1
N$33
  Bottom 0.406: 39.05,54.29 39.05,66.04 36.51,66.04 Q2.3 32.7,64.14 R63.1 | 39.05,54.29 D6.A | C10.2 39.05,48.58 39.05,54.29
N$34  (via drill 0.7)
  Top 0.406: U14.7 v34.29,51.12 | R74.1 34.29,53.98 C14.2
  Bottom 0.406: C14.2 R94.1 D6.C | R74.1 v34.29,51.12 C10.1
N$35
  Top 0.406: U14.3 22.86,49.85 22.86,53.02 R90.2
N$36  (via drill 0.7)
  Top 0.406: U14.2 v24.13,51.12
  Bottom 0.406: R94.2 C14.1 | C14.1 R99.1 26.35,52.7 24.77,51.12 v24.13,51.12 | SYNC2.1 C14.1
N$37
  Top 0.406: R106.1 U10.6 | R84.1 22.23,38.73 22.23,33.34 R83.2
  Bottom 0.406: R106.1 R83.2
N$38
  Bottom 0.406: R12.2 23.81,90.49 23.81,93.34 R2.2
N$39
  Top 0.406: R84.2 25.4,45.09 26.67,43.81 28.26,43.81 R78.2
N$40
  Top 0.406: 26.35,37.47 R70.2 26.35,40.64 R78.3
N$41
  Top 0.406: R38.3 R38.2
  Bottom 0.406: R38.2 18.41,93.03 18.41,88.58 R34.1
N$42
  Top 0.406: U10.9 R100.1
  Bottom 0.406: R110.1 31.43,25.08 34.29,27.94 R100.1
N$43
  Top 0.406: U2.5 R46.2
N$44
  Top 0.406: U2.3 24.45,80.33 24.45,78.74 25.4,77.79 25.4,74.93 R30.1
N$45
  Top 0.406: U2.2 28.26,81.6 28.26,83.82 R34.2 22.54,86.68 R12.1 | R11.1 36.51,89.22 43.5,89.22 R10.1
  Bottom 0.406: R34.2 27.62,88.9 | 27.62,88.9 27.62,95.89 R9.1 | R11.1 33.02,88.9 27.62,88.9
N$46
  Top 0.406: U11.12 53.34,33.34 54.29,34.29 R26.2
  Bottom 0.406: R25.1 R26.2
N$47
  Top 0.406: U11.13 U11.14 52.7,35.88 52.7,38.42 54.29,40.01 54.29,46.04 55.88,47.62 55.88,54.61 54.61,55.88 54.61,61.91 C5.2 | Q3.2 R65.2
  Bottom 0.406: R55.1 58.42,82.87 58.42,77.79 59.05,77.15 59.05,69.85 Q3.2 | C5.2 55.24,61.91 R65.2
N$48
  Top 0.406: U3.1 R47.1
  Bottom 0.406: R39.1 53.02,90.49 53.02,87.31 51.75,86.04 44.45,86.04 43.5,85.09 R47.1
N$49
  Top 0.406: D3.A 41.91,73.03 41.91,68.26 U7.2
  Bottom 0.406: D3.A R47.2 43.5,73.03 R48.1
N$50  (via drill 0.7)
  Top 0.406: v53.66,66.99 U7.6 U7.3 R59.2
  Bottom 0.406: v53.66,66.99 53.66,70.17 55.24,71.75 R66.2
N$51
  Top 0.406: U3.7 C6.2
  Bottom 0.406: C6.2 55.88,80.01 55.88,78.11 R66.1
N$52
  Top 0.406: U7.1 47.31,69.53 48.26,70.48 48.26,72.71 LIN_FM3.1 54.93,76.83 R55.2 55.88,80.33 | C6.1 55.88,82.55 55.88,80.33 | U3.6 55.88,80.33
N$53  (via drill 0.7)
  Top 0.406: Q3.1 U7.8 49.85,69.53 v48.9,68.58 | U11.3 48.26,33.34 v48.26,39.05
  Bottom 0.406: v48.26,39.05 48.9,39.69 C5.1 v48.9,68.58
N$54
  Top 0.406: R85.1 44.77,35.88 U11.1 U11.2
  Bottom 0.406: R85.1 42.23,38.42 42.23,45.72 43.5,46.99 R91.1
N$55
  Bottom 0.406: D3.C 45.09,67.94 45.09,63.5 R59.1
N$56
  Bottom 0.406: 59.05,54.29 59.05,66.04 56.52,66.04 Q3.3 52.7,64.14 R65.1 | 59.05,54.29 D7.A | C11.2 59.05,48.58 59.05,54.29
N$57  (via drill 0.7)
  Top 0.406: U15.7 v54.29,51.12 | R75.1 54.29,53.98 C15.2
  Bottom 0.406: C15.2 R95.1 D7.C | R75.1 v54.29,51.12 C11.1
N$58
  Top 0.406: U15.3 42.86,49.85 42.86,53.02 R91.2
N$59  (via drill 0.7)
  Top 0.406: U15.2 v44.13,51.12
  Bottom 0.406: R95.2 C15.1 | C15.1 R101.1 46.35,52.7 44.77,51.12 v44.13,51.12 | SYNC3.1 C15.1
N$60
  Top 0.406: R107.1 U11.6 | R86.1 42.23,38.73 42.23,33.34 R85.2
  Bottom 0.406: R107.1 R85.2
N$61
  Bottom 0.406: R3.2 62.23,92.71 R16.2
N$62
  Top 0.406: R86.2 45.4,45.09 46.67,43.81 48.26,43.81 R79.2
N$63
  Top 0.406: 46.35,37.47 R71.2 46.35,40.64 R79.3
N$64
  Bottom 0.406: R35.1 57.78,86.04 56.2,86.04 55.56,86.68 55.56,90.17 56.52,91.12 56.52,93.34 R39.2 R39.3
N$65
  Top 0.406: U11.9 R102.1
  Bottom 0.406: R111.1 51.44,25.08 54.29,27.94 R102.1
N$66
  Top 0.406: U3.5 R49.2
N$67
  Top 0.406: U3.3 44.45,80.33 44.45,78.74 45.4,77.79 45.4,74.93 R31.1
N$68
  Top 0.406: R35.2 58.42,80.33 58.42,84.77 57.15,86.04 | R15.1 37.15,87 42.86,81.28 44.13,81.28 44.45,81.6 U3.2 48.26,81.6 48.26,84.77 | 48.26,84.77 R13.1 52.7,86.04 57.15,86.04 | R14.1 47.94,85.09 48.26,84.77 | R16.1 57.15,86.04
N$69
  Top 0.406: U12.12 73.34,33.34 74.3,34.29 R28.2
  Bottom 0.406: R27.1 R28.2
N$70
  Top 0.406: U12.13 U12.14 72.71,35.88 72.71,38.42 74.3,40.01 74.3,46.04 75.88,47.62 75.88,54.61 74.61,55.88 74.61,61.91 C7.2 | Q4.2 R67.2
  Bottom 0.406: R56.1 78.74,82.55 78.74,69.53 Q4.2 | C7.2 75.25,61.91 R67.2
N$71
  Top 0.406: U4.1 R50.1
  Bottom 0.406: R40.1 64.45,91.76 64.45,83.82 R50.1
N$72
  Top 0.406: D4.A 61.91,73.03 61.91,68.26 U8.2
  Bottom 0.406: D4.A R50.2 63.5,73.03 R51.1
N$73  (via drill 0.7)
  Top 0.406: v73.66,66.99 U8.6 U8.3 R60.2
  Bottom 0.406: v73.66,66.99 73.66,70.17 75.25,71.75 R68.2
N$74
  Top 0.406: U4.7 C8.2
  Bottom 0.406: C8.2 75.88,80.01 75.88,78.11 R68.1
N$75
  Top 0.406: U8.1 67.31,69.53 68.26,70.48 68.26,72.71 LIN_FM4.1 74.93,76.83 R56.2 75.88,80.33 | C8.1 75.88,82.55 75.88,80.33 | U4.6 75.88,80.33
N$76  (via drill 0.7)
  Top 0.406: Q4.1 U8.8 69.85,69.53 v68.9,68.58 | U12.3 68.26,33.34 v68.26,39.05
  Bottom 0.406: v68.26,39.05 68.9,39.69 C7.1 v68.9,68.58
N$77
  Top 0.406: R87.1 64.77,35.88 U12.1 U12.2
  Bottom 0.406: R87.1 62.23,38.42 62.23,45.72 63.5,46.99 R92.1
N$78
  Bottom 0.406: D4.C 65.09,67.94 65.09,63.5 R60.1
N$79
  Bottom 0.406: 78.74,54.29 78.74,66.04 76.52,66.04 Q4.3 72.71,64.14 R67.1 | 78.74,54.29 D8.A | C12.2 78.74,48.58 78.74,54.29
N$80  (via drill 0.7)
  Top 0.406: U16.7 v74.3,51.12 | R76.1 74.3,53.98 C16.2
  Bottom 0.406: C16.2 R96.1 D8.C | R76.1 v74.3,51.12 C12.1
N$81
  Top 0.406: U16.3 62.87,49.85 62.87,53.02 R92.2
N$82  (via drill 0.7)
  Top 0.406: U16.2 v64.14,51.12
  Bottom 0.406: R96.2 C16.1 | C16.1 R103.1 66.36,52.7 64.77,51.12 v64.14,51.12 | SYNC4.1 C16.1
N$83
  Top 0.406: R108.1 U12.6 | R88.1 62.23,38.73 62.23,33.34 R87.2
  Bottom 0.406: R108.1 R87.2
N$84
  Bottom 0.406: R20.2 72.07,89.53 72.07,93.03 R4.2
N$85
  Top 0.406: R88.2 65.41,45.09 66.67,43.81 68.26,43.81 R80.2
N$86
  Top 0.406: 66.36,37.47 R72.2 66.36,40.64 R80.3
N$87
  Top 0.406: R40.3 R40.2
  Bottom 0.406: R40.2 68.26,91.76 68.26,89.85 R36.1
N$88
  Top 0.406: U12.9 R104.1
  Bottom 0.406: R112.1 71.44,25.08 74.3,27.94 R104.1
N$89
  Top 0.406: U4.5 R52.2
N$90
  Top 0.406: U4.3 64.45,80.33 64.45,78.74 65.41,77.79 65.41,74.93 R32.1
N$91
  Top 0.406: 68.26,84.45 68.26,81.6 U4.2 | 68.26,84.45 68.26,86.68 R36.2 | R18.1 52.07,88.9 R20.1 | R17.1 68.26,84.45
  Bottom 0.406: R18.1 48.58,89.22 41.59,89.22 R19.1 | R20.1 R36.2
N$93
  Top 0.406: 11.43,86.68 8.26,83.5 8.26,81.6 U1.2 | 11.43,86.68 R33.2 14.61,86.68 18.73,90.81 25.72,90.81 29.21,87.31 | 11.43,86.68 R8.1 | 29.21,87.31 R7.1 | R5.1 29.21,87.31
  Bottom 0.406: R7.1 33.66,85.72 41.27,85.72 R6.1
N$162  (via drill 3.2)
  other vias: 76,4
N$163  (via drill 3.2)
  other vias: 4,4
N$164  (via drill 3.2)
  other vias: 76,96
N$165  (via drill 3.2)
  other vias: 4,96
NOTHING
  Top 0.406: R109.2 5.4,24.45 | U9.7 6.35,28 6.35,26.99 WAVE1.1 5.4,24.45 | R105.2 5.4,24.45
NOTHING1
  Top 0.406: R110.2 25.4,24.45 | U10.7 26.35,28 26.35,26.99 WAVE2.1 25.4,24.45 | R106.2 25.4,24.45
NOTHING2
  Top 0.406: R111.2 45.4,24.45 | U11.7 46.35,28 46.35,26.99 WAVE3.1 45.4,24.45 | R107.2 45.4,24.45
NOTHING3
  Top 0.406: R112.2 65.41,24.45 | U12.7 66.36,28 66.36,26.99 WAVE4.1 65.41,24.45 | R108.2 65.41,24.45
OUT1
  Top 0.406: R98.2 14.29,26.99 13.02,28.26 U9.8
  Bottom 0.406: R98.2 17.78,20.64 17.78,14.61 23.5,8.89 35.88,8.89 37.47,7.3 OUT.2
OUT2
  Top 0.406: R100.2 34.29,26.99 33.02,28.26 U10.8
  Bottom 0.406: R100.2 37.78,20.64 37.78,9.84 40.01,7.62 OUT.3
OUT3
  Top 0.406: R102.2 54.29,26.99 53.02,28.26 U11.8
  Bottom 0.406: R102.2 57.78,20.64 57.78,11.43 56.52,10.16 49.21,10.16 47.31,8.26 43.18,8.26 42.55,7.62 OUT.4
OUT4
  Top 0.406: R104.2 74.3,26.99 73.03,28.26 U12.8
  Bottom 0.406: R104.2 77.79,20.64 77.79,12.06 74.61,8.89 49.53,8.89 46.35,5.71 OUT.5
PANEL
  Top 0.813: OUT.1 34.92,1.59 17.46,1.59 17.46,5.08 POWER.2 17.46,5.16 17.46,6.35 14.29,9.53 9.84,9.53 JP2.1
TUNE1
  Bottom 0.406: TUNE.4 R6.2
TUNE2
  Bottom 0.406: TUNE.3 R10.2
TUNE3
  Bottom 0.406: TUNE.2 R14.2
TUNE4
  Bottom 0.406: TUNE.1 R18.2
V+_1  (via drill 0.7)
  Top 0.406: U13.8 9.53,52.39 9.53,49.85 U13.6 U13.5 | U13.5 11.43,48.58 | C37.2 15.88,22.86 15.88,40.96 R21.2 | v9.53,82.87 U1.8 | U13.5 11.49,47.25 v11.75,46.99
  Bottom 0.406: 10.16,46.99 C25.2 10.16,82.23 v9.53,82.87 | 10.16,46.99 v11.75,46.99 14.29,46.99 | 10.16,46.99 C21.2 | 14.29,46.99 14.29,45.09 R21.2 | U17.1 C37.2 | R73.2 14.29,46.99
V+_2  (via drill 0.7)
  Top 0.406: U14.6 U14.5 | C39.2 35.88,22.86 35.88,40.96 R23.2 | v29.53,82.87 U2.8 | U14.5 31.49,47.25 v31.75,46.99 | U14.8 29.53,52.39 29.53,48.58 U14.5
  Bottom 0.406: 34.29,46.99 v31.75,46.99 30.16,46.99 | 30.16,46.99 C26.2 30.16,82.23 v29.53,82.87 | 30.16,46.99 C22.2 | R74.2 34.29,46.99 | 34.29,46.99 34.29,45.09 R23.2 | U19.1 C39.2
V+_3  (via drill 0.7)
  Top 0.406: U15.6 U15.5 | C41.2 55.88,22.86 55.88,40.96 R25.2 | v49.53,82.87 U3.8 | U15.8 49.53,52.39 49.53,48.58 U15.5 | U15.5 51.49,47.25 v51.75,46.99
  Bottom 0.406: 50.16,48.58 R75.2 54.29,45.09 R25.2 | 50.16,48.58 C27.2 50.16,82.23 v49.53,82.87 | 50.16,48.58 50.16,46.99 | 50.16,46.99 C23.2 | U21.1 C41.2 | v51.75,46.99 50.16,46.99
V+_4  (via drill 0.7)
  Top 0.406: U16.6 U16.5 | C43.2 75.88,22.86 75.88,40.96 R27.2 | v69.53,82.87 U4.8 | U16.8 69.53,52.39 69.53,48.58 U16.5 | U16.5 71.44,48.58 71.44,47.31 v71.75,46.99
  Bottom 0.406: 70.17,48.58 R76.2 74.3,45.09 R27.2 | 70.17,48.58 C28.2 70.17,82.23 v69.53,82.87 | 70.17,48.58 70.17,46.99 | 70.17,46.99 C24.2 | U23.1 C43.2 | v71.75,46.99 70.17,46.99
V-_1  (via drill 0.7)
  Top 0.406: U13.1 8.26,52.39 8.26,48.58 U13.4 6.29,47.25 v6.03,46.99 | C25.1 7.62,79.06 U1.4
  Bottom 0.406: C21.1 6.35,44.77 6.35,40.01 4.76,38.42 4.76,37.15 5.71,36.2 5.71,29.21 1.91,25.4 1.91,22.54 C38.1 U18.3 | C21.1 7.62,46.99 v6.03,46.99 | C25.1 C21.1
V-_2  (via drill 0.7)
  Top 0.406: C26.1 27.62,79.06 U2.4 | U14.1 28.26,52.39 28.26,48.58 U14.4 26.29,47.25 v26.04,46.99
  Bottom 0.406: 27.62,46.99 C22.1 26.35,44.77 26.35,40.01 24.77,38.42 24.77,37.15 25.72,36.2 25.72,29.21 21.91,25.4 21.91,22.86 C40.1 U20.3 | C26.1 27.62,46.99 | 27.62,46.99 v26.04,46.99
V-_3  (via drill 0.7)
  Top 0.406: C27.1 47.62,79.06 U3.4 | U15.1 48.26,52.39 48.26,48.58 46.35,48.58 | 46.35,48.58 U15.4 | 46.35,48.58 46.35,47.31 v46.04,46.99
  Bottom 0.406: C27.1 47.62,46.67 | 47.62,46.67 C23.1 46.35,44.77 46.35,40.01 44.77,38.42 44.77,37.15 45.72,36.2 45.72,29.21 41.91,25.4 41.91,22.86 C42.1 U22.3 | v46.04,46.99 47.31,46.99 47.62,46.67
V-_4  (via drill 0.7)
  Top 0.406: C28.1 67.63,79.06 U4.4 | U16.1 68.26,52.39 68.26,48.58 U16.4 66.3,47.25 v66.04,46.99
  Bottom 0.406: C28.1 67.63,46.99 | 67.63,46.99 C24.1 66.36,44.77 66.36,40.01 64.77,38.42 64.77,37.15 65.72,36.2 65.72,29.21 61.91,25.4 61.91,22.86 C44.1 U24.3 | v66.04,46.99 67.63,46.99

### Text on the board
tPlace: Track | Tune | Track | Tune | Track | Tune | Track | Tune | Panel | GND | GND | -15V | +15V
tNames: 1&2 | +15V | C tune | Potmeter / voltages | CV input | Tune | -15V | 3&4 | wave / bal. | wave / bal. | wave / bal. | wave / bal. | SAW 1 | SAW 2 | SAW 3 | SAW 4 | Gang of Four | Quad Saw VCO | 4B | Power | Audio out | Rev 1.1